# Altium schematic sheet MicroMultimeter_BUZZER_Sch.SchDoc: MicroMultimeter - Buzzer
size 127 x 101 mm; Author: Hom; CompanyName: KitSprout; DrawnBy: Hom; Engineer: Hom; Organization: KitSprout; Revision: A; SheetNumber: 1; SheetTotal: 1; License: CC BY-SA 4.0; Version: 1.0; LibVersion: 1.4; PageSetup: Record=PageOptions|CenterHorizontal=True|CenterVertical=True|PrintScale=1.00|XCorrection=1.00|YCorrection=1.00|PrintKind=0|BorderSize=5000000|LeftOffset=0|BottomOffset=0|Orientation=2|PaperLength=1000|PaperWidth=1000|Scale=100|PaperSource=7|PrintQuality=-3|MediaType=1|DitherType=10|PrintScaleMode=0|PaperKind=A4|PaperIndex=9
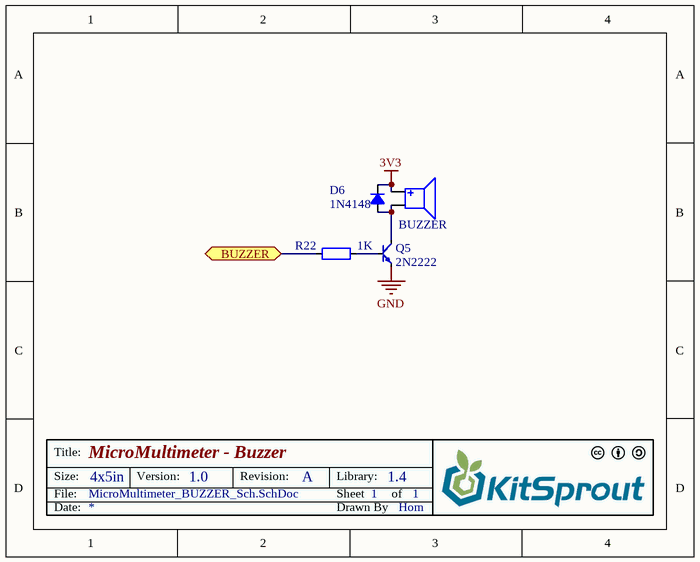
[diagram p0: MicroMultimeter_BUZZER_Sch.SchDoc]

## Parts
BUZZER  Buzzer  [Buzzer_5x5]  (value not drawn)
D6  value 1N4148  [SOD323]  (hidden comment: Diode_SOD323)
Q5  value 2N2222  [SOT23-3]  (hidden comment: BJT_NPN)
R22  value 1K  [RES_0603]  (hidden comment: Res_0603)

## Ports
BUZZER

## Nets
3V3: BUZZER.P(Positive) D6.2(K)
GND: Q5.2(E)
BUZZER: R22.2 ; port BUZZER
NetBUZZER_N: BUZZER.N(Negative) D6.1(A) Q5.3(C)
NetQ5_1: Q5.1(B) R22.1

## Notes on the sheet
- Title:
- Size:
- Date:
- File:
- 4x5in
- Version:
- Revision:
- Sheet
- Drawn By
- Library:
- of

## Library data of the parts
D6 = Diode_SOD323: Diode
Q5 = BJT_NPN: Transistor
R22 = Res_0603: Resistor